# EAGLE design ABC (EAGLE 6.3)
ABC - Advanced Battery Charger Intel Galileo shield with buttons, ADC divider/amplifier Cezary Rutkowski diploma work Wojskowa Akademia Techniczna
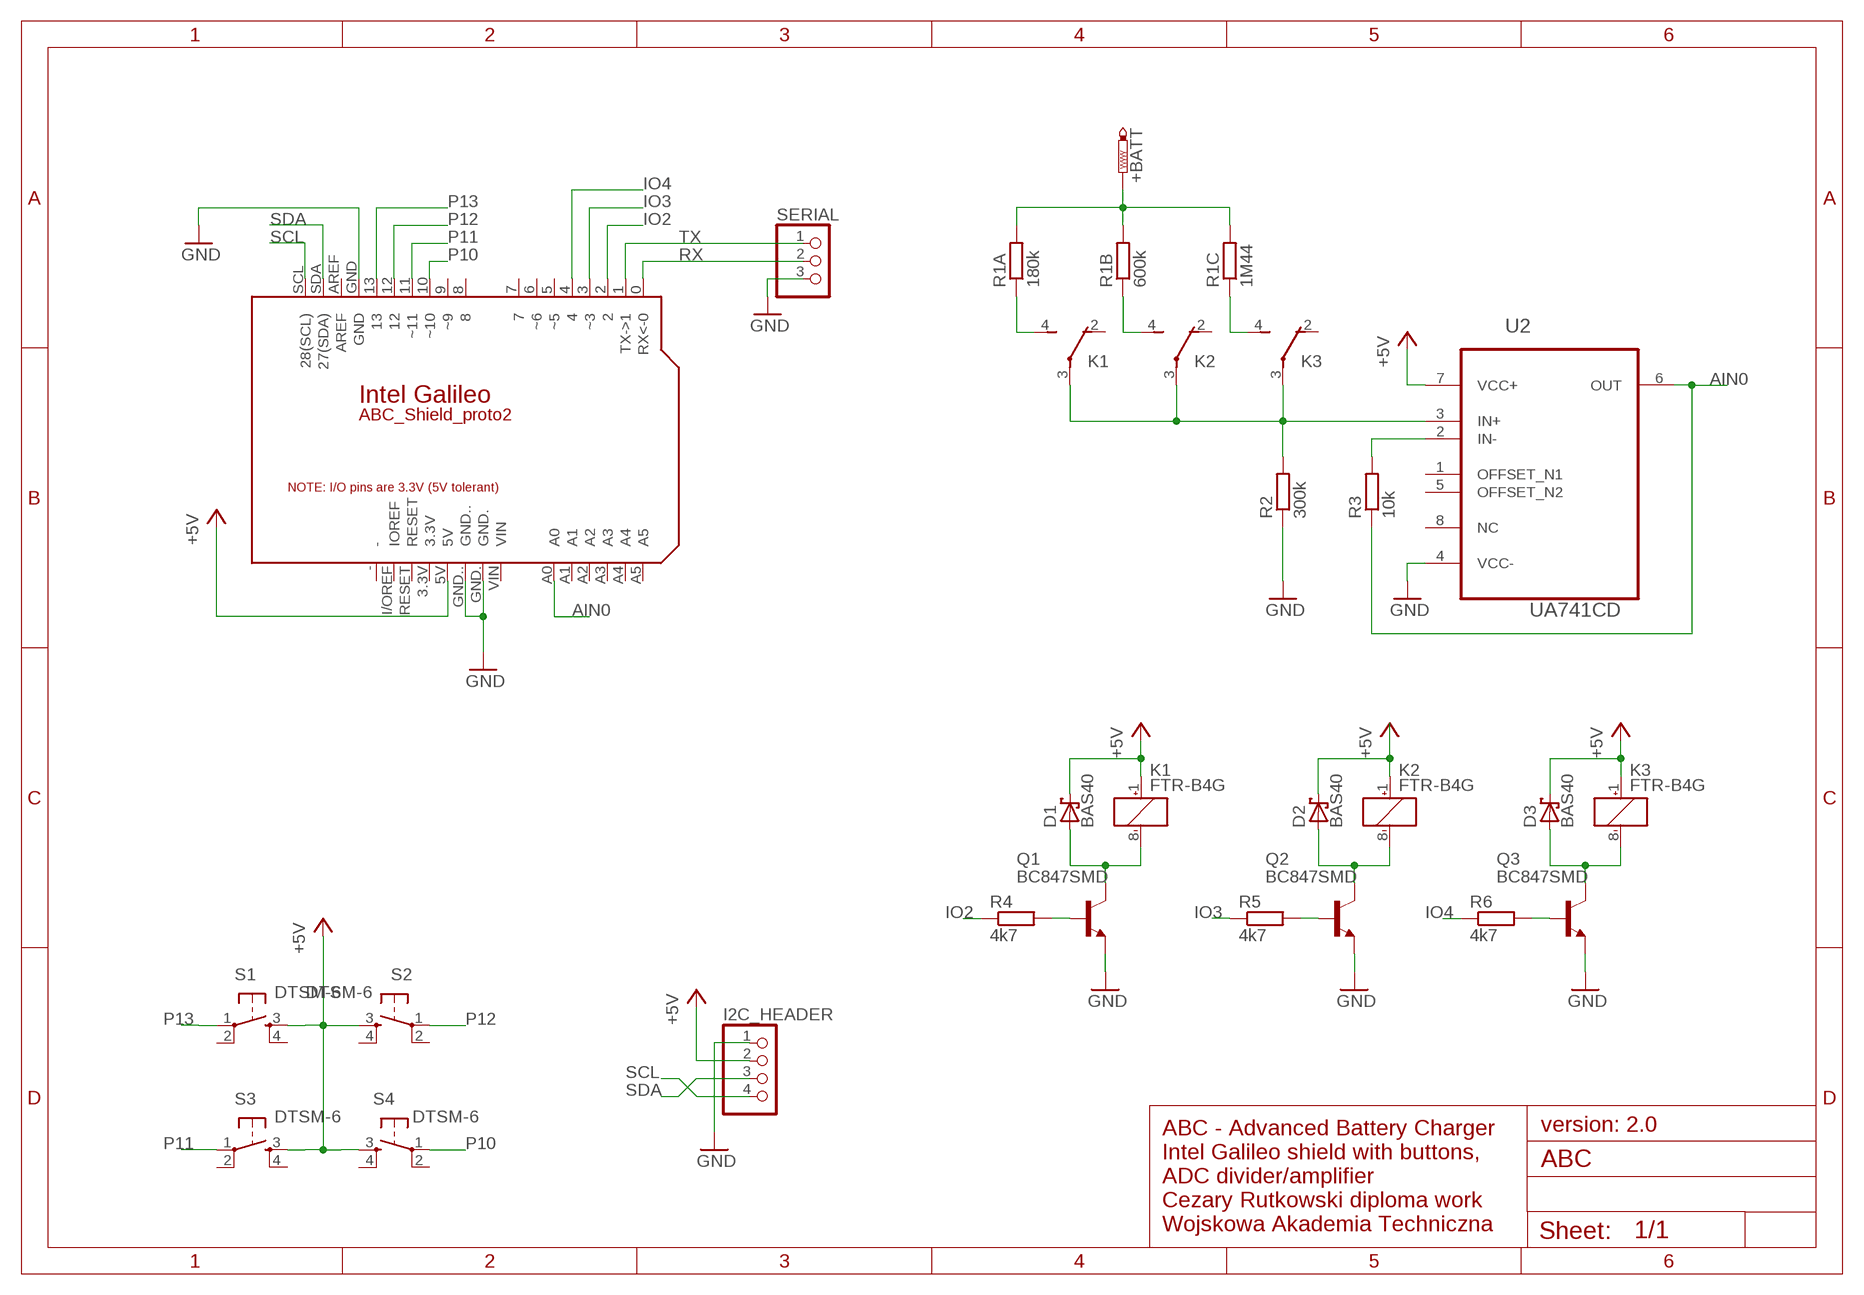
[diagram p0: schematic, sheet 1]

## Parts
+BATT  PTR1PAD1-20Y  [P1-20Y]
D1  BAS40  [SOT23]
D2  BAS40  [SOT23]
D3  BAS40  [SOT23]
I2C_HEADER  PINHD-1X4  [1X04]
K1  FTR-B4G  [FTR-B4G]
K2  FTR-B4G  [FTR-B4G]
K3  FTR-B4G  [FTR-B4G]
PCB1  ARDUINO_101  [ARDUINO_GALILEO]
Q1  BC847SMD  [SOT23]
Q2  BC847SMD  [SOT23]
Q3  BC847SMD  [SOT23]
R1A  180k  R-EU_M1206  [M1206]
R1B  600k  R-EU_M1206  [M1206]
R1C  1M44  R-EU_M1206  [M1206]
R2  300k  R-EU_M1206  [M1206]
R3  10k  R-EU_M1206  [M1206]
R4  4k7  R-EU_M1206  [M1206]
R5  4k7  R-EU_M1206  [M1206]
R6  4k7  R-EU_M1206  [M1206]
S1  DTSM-6  [DTSM-6]
S2  DTSM-6  [DTSM-6]
S3  DTSM-6  [DTSM-6]
S4  DTSM-6  [DTSM-6]
SERIAL  PINHD-1X3  [1X03]
U2  UA741CD  [SOIC127P600X175-8N]

## Nets
+5V: D1.3(C) D2.3(C) D3.3(C) I2C_HEADER.2 K1.1(K:+) K2.1(K:+) K3.1(K:+) PCB1.5V S1.3 S2.3 S3.3 S4.3 U2.7(VCC+)
AIN0: PCB1.A0 R3.1 U2.6(OUT)
DIV: K1.3(-1:P) K2.3(-1:P) K3.3(-1:P) R2.2 U2.3(IN+)
GND: I2C_HEADER.1 PCB1.GND PCB1.GND. PCB1.GND.. Q1.2(E) Q2.2(E) Q3.2(E) R2.1 SERIAL.3 U2.4(VCC-)
IO2: PCB1.2 R4.1
IO3: PCB1.3(~3) R5.1
IO4: PCB1.4 R6.1
N$1: R3.2 U2.2(IN-)
N$2: K1.4(-1:S) R1A.1
N$3: +BATT.TP R1A.2 R1B.2 R1C.2
N$4: K2.4(-1:S) R1B.1
N$5: K3.4(-1:S) R1C.1
N$6: Q1.1(B) R4.2
N$7: D1.1(A) K1.8(K:-) Q1.3(C)
N$8: Q2.1(B) R5.2
N$9: D2.1(A) K2.8(K:-) Q2.3(C)
N$10: Q3.1(B) R6.2
N$11: D3.1(A) K3.8(K:-) Q3.3(C)
P10: PCB1.10(~10) S4.1
P11: PCB1.11(~11) S3.1
P12: PCB1.12 S2.1
P13: PCB1.13 S1.1
RX: PCB1.0(RX<-0) SERIAL.2
SCL: I2C_HEADER.4 PCB1.SCL(28(SCL))
SDA: I2C_HEADER.3 PCB1.SDA(27(SDA))
TX: PCB1.1(TX->1) SERIAL.1
Unconnected: K1.2(-1:O) K1.5(-2:S) K1.6(-2:P) K1.7(-2:O) K2.2(-1:O) K2.5(-2:S) K2.6(-2:P) K2.7(-2:O) K3.2(-1:O) K3.5(-2:S) K3.6(-2:P) K3.7(-2:O) PCB1.3.3V PCB1.5(~5) PCB1.6(~6) PCB1.7 PCB1.8 PCB1.9(~9) PCB1.- PCB1.A1 PCB1.A2 PCB1.A3 PCB1.A4 PCB1.A5 PCB1.AREF PCB1.I/OREF(IOREF) PCB1.RESET PCB1.VIN S1.2 S1.4 S2.2 S2.4 S3.2 S3.4 S4.2 S4.4 U2.1(OFFSET_N1) U2.5(OFFSET_N2) U2.8(NC)

## Notes on the sheet
- ABC_Shield_proto2
- version: 2.0
- ABC - Advanced Battery Charger
  Intel Galileo shield with buttons, 
  ADC divider/amplifier
  Cezary Rutkowski diploma work
  Wojskowa Akademia Techniczna

## Library data of the parts
+BATT = testpad:PTR1: TEST PIN
D1-D3 = diode:BAS40: Silicon Schottky Diodes General-purpose diode for high-speed switching
I2C_HEADER = pinhead:PINHD-1X4: PIN HEADER
K1-K3 = relay:FTR-B4: ULTRA MINIATURE RELAY 2 POLES - 2 A (Slim Profile Signal Relay) FUJITSU FTR-B4 SERIES Source: FTR-B4.pdf
PCB1 = Arduino:ARDUINO_101: Schematic symbol for representing an Arduino/Genuino 101 board in an EAGLE schematic. Created by Dave Young for Element14. More 101 documentation at: https://www.element14.com/community/docs/DOC-80459/l/intel-genuino-101-development-board More EAGLE documentation at: http://www.element14.com/community/community/knode/cadsoft_eagle
Q1-Q3 = transistor-npn:BC847*: NPN Transistor
R1A R1B R1C R2-R6 = resistor:R-EU_: RESISTOR, European symbol
S1-S4 = switch-tact:DTSM-6
SERIAL = pinhead:PINHD-1X3: PIN HEADER
U2 = Texas Instruments:UA741CD: GENERAL-PURPOSE OPERATIONAL AMPLIFIERS; MPN: UA741CD; OC_FARNELL: 1106042; OC_NEWARK: 67K2884; PACKAGE: SOIC-8; SUPPLIER: Texas Instruments

## Board
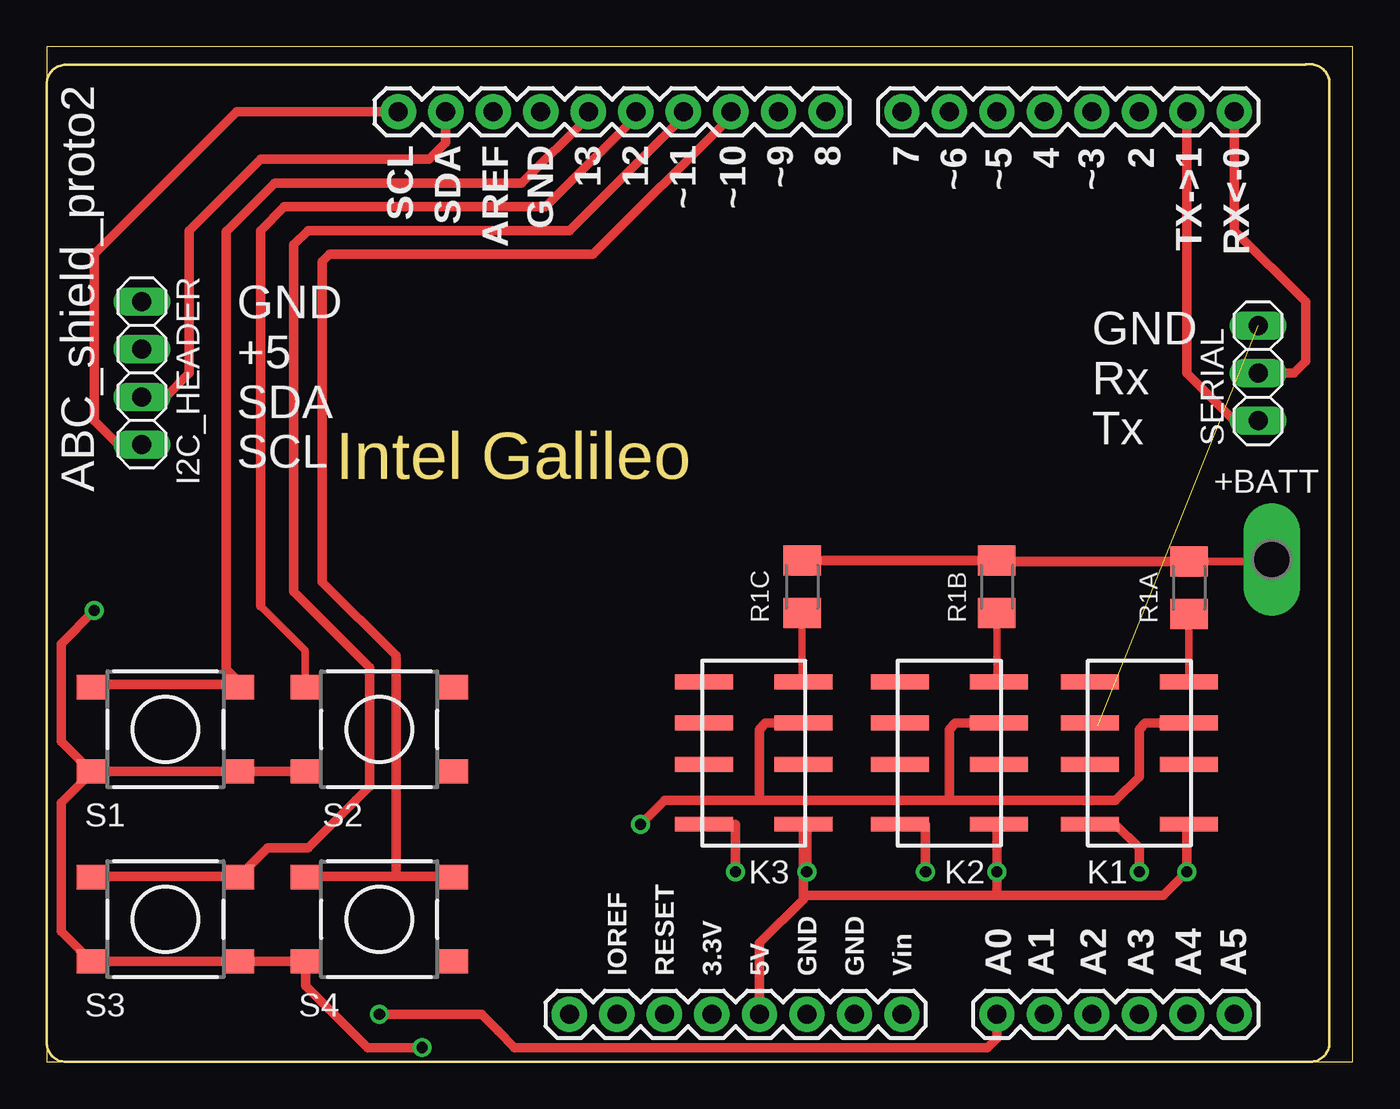
[diagram p1: board, top side]
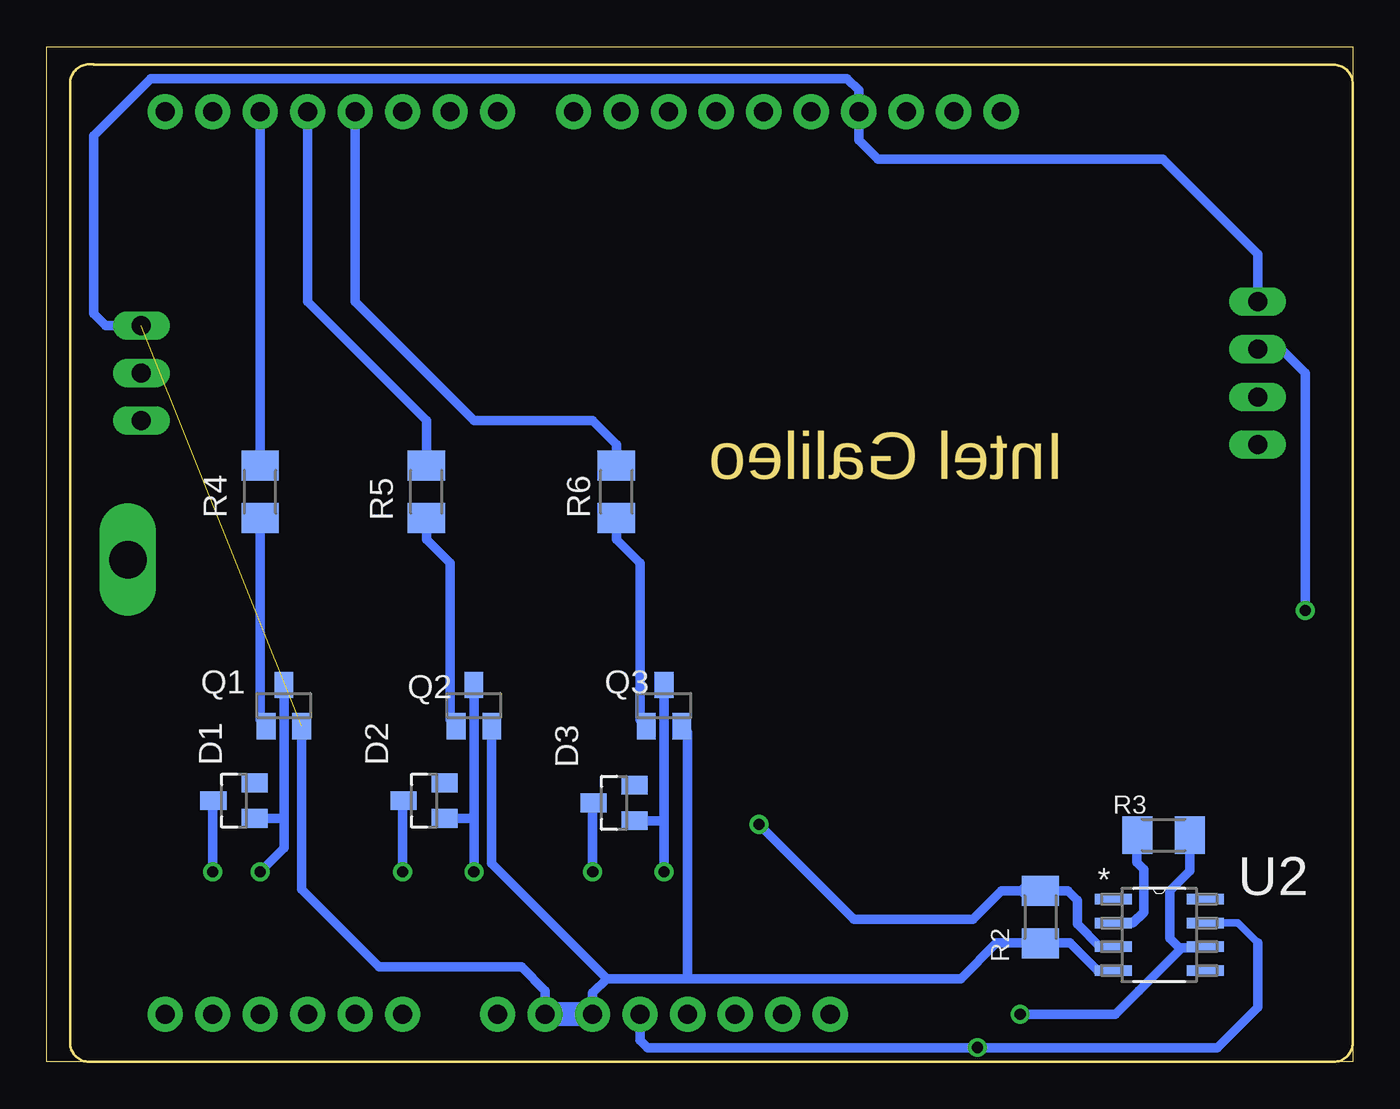
[diagram p2: board, bottom side, seen from below]

Size 69.83 x 54.28 mm. Coordinates in mm from the lower left corner, seen from the top.
Outline: 0,0 69.83,0 69.83,54.28 0,54.28 0,0
Copper layers (1*16): Top 0.035mm / dielectric 1.5mm / Bottom 0.035mm
Design rules "default": minimum track width 10mil, minimum drill 24mil, track to track 8mil, track to pad 8mil, pad to pad 8mil, via to via 8mil, smd to smd 8mil, copper to edge 40mil, drill to drill 8mil, minimum pad ring 10mil, minimum via ring 8mil, stop-mask expansion 4mil, vias tented up to drill 0mil, thermal gap 10mil

### Footprints (pad centres in the part's own frame; a part is rotated, then mirrored left to right if it is on the bottom)
P1-20Y = drill 2.007 pad 2.54 long: TP 0,0
SOT23 = smd 1 x 1.4: 1 -0.95,-1.1; 2 0.95,-1.1; 3 0,1.1
1X04 = drill 1.016 long: 1 -3.81,0; 2 -1.27,0; 3 1.27,0; 4 3.81,0
FTR-B4G = smd 0.8 x 3.1: 1 -3.8,-2.65; 2 -0.6,-2.65; 3 1.6,-2.65; 4 3.8,-2.65; 5 3.8,2.65; 6 1.6,2.65; 7 -0.6,2.65; 8 -3.8,2.65
ARDUINO_GALILEO = drill 1.016 pad 1.88: 0 27.94,25.4; 1 25.4,25.4; 2 22.86,25.4; 3 20.32,25.4; 3.3V 0,-22.86; 4 17.78,25.4; 5 15.24,25.4; 5V 2.54,-22.86; 6 12.7,25.4; 7 10.16,25.4; 8 6.096,25.4; 9 3.556,25.4; 10 1.016,25.4; 11 -1.524,25.4; 12 -4.064,25.4; 13 -6.604,25.4; - -7.62,-22.86; A0 15.24,-22.86; A1 17.78,-22.86; A2 20.32,-22.86; A3 22.86,-22.86; A4 25.4,-22.86; A5 27.94,-22.86; AREF -11.684,25.4; GND -9.144,25.4; GND. 7.62,-22.86; GND.. 5.08,-22.86; I/OREF -5.08,-22.86; RESET -2.54,-22.86; SCL -16.764,25.4; SDA -14.224,25.4; VIN 10.16,-22.86
M1206 = smd 1.6 x 2: 1 -1.4,0; 2 1.4,0
DTSM-6 = smd 1.55 x 1.3: 1 -3.975,2.25; 2 3.975,2.25; 3 -3.975,-2.25; 4 3.975,-2.25
1X03 = drill 1.016 long: 1 -2.54,0; 2 0,0; 3 2.54,0
SOIC127P600X175-8N = smd 1.981 x 0.559: 1 -2.464,1.905; 2 -2.464,0.635; 3 -2.464,-0.635; 4 -2.464,-1.905; 5 2.464,-1.905; 6 2.464,-0.635; 7 2.464,0.635; 8 2.464,1.905

### Placement (x,y rotation side)
+BATT  65.5,26.86 0 top
D1  59.82,13.97 90 bottom
D2  49.66,13.97 90 bottom
D3  39.5,13.84 90 bottom
I2C_HEADER  5.08,36.83 270 top
K1  58.42,16.51 90 top
K2  48.26,16.51 90 top
K3  37.8,16.51 90 top
PCB1  35.56,25.4 0 top
Q1  57.15,19.05 0 bottom
Q2  46.99,19.05 0 bottom
Q3  36.83,19.05 0 bottom
R1A  61.07,25.35 90 top
R1B  50.8,25.4 90 top
R1C  40.39,25.4 90 top
R2  16.7,7.74 90 bottom
R3  10.11,12.13 180 bottom
R4  58.42,30.48 270 bottom
R5  49.53,30.48 270 bottom
R6  39.37,30.48 270 bottom
S1  6.35,17.78 0 top
S2  17.78,17.78 0 top
S3  6.35,7.62 0 top
S4  17.78,7.62 0 top
SERIAL  64.77,36.83 90 top
U2  10.35,6.79 0 bottom

### Tracks (layer width: path | path; a pad name or v marks a point on that pad's centre or on a via)
+5V  (via drill 0.6)
  Top 0.406: 13.84,5.33 S4.3 | 2.38,15.46 S1.3 | 13.8,15.46 S2.3
  Top 0.5: K2.1 50.8,12.6 v50.8,10.16 50.8,8.89 | K1.1 60.96,12.6 v60.96,10.16 59.69,8.89 50.8,8.89 | v40.64,10.16 40.64,12.52 K3.1 40.45,8.89 | 40.45,8.89 40.45,8.7 38.1,6.35 PCB1.5V | S4.3 S3.3 0.76,6.98 0.76,13.84 2.38,15.46 | v2.54,24.13 0.76,22.35 0.76,17.14 S1.3 S2.3 | 50.8,8.89 40.45,8.89 | 13.84,5.33 13.84,4.06 17.14,0.76 v20.07,0.76
  Bottom 0.406: U2.7 6.15,7.42 5.08,6.35 | D1.3 60.96,13.97 | D2.3 50.8,13.97 | D3.3 40.64,13.84
  Bottom 0.5: I2C_HEADER.2 3.81,38.1 2.54,36.83 v2.54,24.13 | v20.07,0.76 20.7,0.76 | 20.7,0.76 37.72,0.76 38.1,1.14 PCB1.5V | 5.08,6.35 5.08,2.92 7.24,0.76 20.7,0.76 | 60.96,13.97 v60.96,10.16 | 50.8,13.97 v50.8,10.16 | 40.64,13.84 v40.64,10.16
AIN0  (via drill 0.6)
  Top 0.5: PCB1.A0 50.8,1.27 50.29,0.76 25.02,0.76 24.13,1.65 23.24,2.54 v17.78,2.54
  Bottom 0.406: 9.14,6.1 8.89,6.1
  Bottom 0.5: R3.1 8.71,10.21 9.78,9.14 9.78,6.6 9.27,6.1 8.89,6.1 7.94,6.1 U2.6 | v17.78,2.54 12.7,2.54 11.43,3.81 9.14,6.1
DIV  (via drill 0.6)
  Top 0.5: K1.3 58.75,18.11 58.42,17.78 58.42,15.24 57.15,13.97 48.26,13.97 | 48.26,13.97 38.1,13.97 | 38.1,13.97 33.02,13.97 v31.75,12.7 | K2.3 48.59,18.11 48.26,17.78 48.26,13.97 | K3.3 38.43,18.11 38.1,17.78 38.1,13.97
  Bottom 0.5: U2.3 13.52,6.15 14.73,7.37 14.73,8.64 15.24,9.14 R2.2 | 17.53,9.14 18.8,9.14 20.32,7.62 21.59,7.62 26.67,7.62 v31.75,12.7
  Bottom 0.813: 17.53,9.14 R2.2
GND  (1 unrouted)
  Bottom 0.406: R2.1
  Bottom 0.5: I2C_HEADER.1 5.08,43.18 10.16,48.26 25.4,48.26 26.42,49.28 26.42,49.53 PCB1.GND 26.42,51.94 27.05,52.58 64.26,52.58 67.31,49.53 67.31,40.01 66.67,39.37 SERIAL.3 | R2.1 15.11,6.35 13.64,4.88 U2.4 12.76,4.83 | PCB1.GND.. 40.64,3.68 39.88,4.45 | 39.88,4.45 35.56,4.45 | Q2.2 46.04,10.61 39.88,4.45 | Q1.2 56.2,9.21 52.07,5.08 44.45,5.08 43.18,3.81 PCB1.GND. | Q3.2 35.56,17.63 35.56,4.45 | 35.56,4.45 20.95,4.45 19.05,6.35 R2.1
  Bottom 1.27: PCB1.GND.. PCB1.GND.
IO2
  Bottom 0.5: PCB1.2 R4.1
IO3
  Bottom 0.5: PCB1.3 55.88,40.64 49.53,34.29 R5.1
IO4
  Bottom 0.5: PCB1.4 53.34,40.64 46.99,34.29 40.64,34.29 39.37,33.02 R6.1
N$1
  Bottom 0.5: U2.2 11.76,7.42 11.18,8 11.18,10.29 11.56,10.67 11.56,12.08 R3.2
N$2
  Top 0.406: R1A.1 K1.4
N$3
  Top 0.406: R1A.2 65.39,26.75 +BATT.TP
  Top 0.5: R1A.2 50.85,26.75 | R1B.2 R1C.2
  Top 0.813: 50.85,26.75 R1B.2
N$4
  Top 0.406: R1B.1 50.8,20.42
  Top 0.813: 50.8,20.42 K2.4
N$5
  Top 0.406: 40.39,20.37 R1C.1
  Top 0.813: 40.39,20.37 K3.4
N$6
  Bottom 0.5: R4.2 58.42,18.27 Q1.1
N$7  (via drill 0.6)
  Top 0.5: v58.42,10.16 58.42,11.43 57.15,12.7 K1.8
  Bottom 0.406: D1.1 58.42,13.02 | 57.15,13.02 57.15,12.7
  Bottom 0.5: Q1.3 57.15,12.7 57.15,11.43 v58.42,10.16 | 58.42,13.02 57.15,13.02
N$8
  Bottom 0.5: R5.2 49.53,27.94 48.26,26.67 48.26,18.27 Q2.1
N$9  (via drill 0.6)
  Top 0.5: v46.99,10.16 46.99,12.7 K2.8
  Bottom 0.406: 46.99,13.02 46.99,12.7
  Bottom 0.5: Q2.3 46.99,12.7 v46.99,10.16 | D2.1 46.99,13.02
N$10
  Bottom 0.5: R6.2 39.37,27.94 38.1,26.67 38.1,18.27 Q3.1
N$11  (via drill 0.6)
  Top 0.5: v36.83,10.16 36.83,12.7 K3.8
  Bottom 0.406: 36.83,12.89 36.83,12.7
  Bottom 0.5: Q3.3 36.83,12.7 v36.83,10.16 | D3.1 36.83,12.89
P10
  Top 0.5: PCB1.10 36.58,50.55 29.21,43.18 15.11,43.18 14.73,42.8 14.73,25.65 18.67,21.72 18.67,11.94 18.67,9.91 20.7,9.91 21.84,9.91 13.84,9.91 S4.1
P11
  Top 0.5: PCB1.11 34.04,50.55 27.94,44.45 13.97,44.45 13.21,43.69 13.21,25.15 17.27,21.08 17.27,14.73 16.51,13.97 13.97,11.43 11.81,11.43 10.29,9.91 2.41,9.91 S3.1
P12
  Top 0.406: 11.43,24.38 13.8,22.01 S2.1
  Top 0.5: PCB1.12 31.5,50.55 26.67,45.72 12.7,45.72 11.43,44.45 11.43,24.38
P13
  Top 0.406: 2.54,20.19 S1.1
  Top 0.5: PCB1.13 28.96,50.55 25.4,46.99 12.19,46.99 9.65,44.45 9.6,44.4 9.6,21.01 10.41,20.19 2.54,20.19
RX
  Top 0.5: PCB1.0 63.5,44.45 67.31,40.64 67.31,37.47 66.67,36.83 SERIAL.2
SCL
  Top 0.5: I2C_HEADER.4 3.81,33.02 2.54,34.29 2.54,43.18 10.16,50.8 PCB1.SCL
SDA
  Top 0.5: I2C_HEADER.3 6.35,35.56 7.62,36.83 7.62,44.45 11.43,48.26 20.45,48.26 21.34,49.15 PCB1.SDA
TX
  Top 0.5: PCB1.1 60.96,36.83 63.5,34.29 SERIAL.1

### Text on the board
tNames: GND / Rx / Tx | GND / +5 / SDA / SCL | ABC_shield_proto2